# Altium project RBE3002.PrjPcb
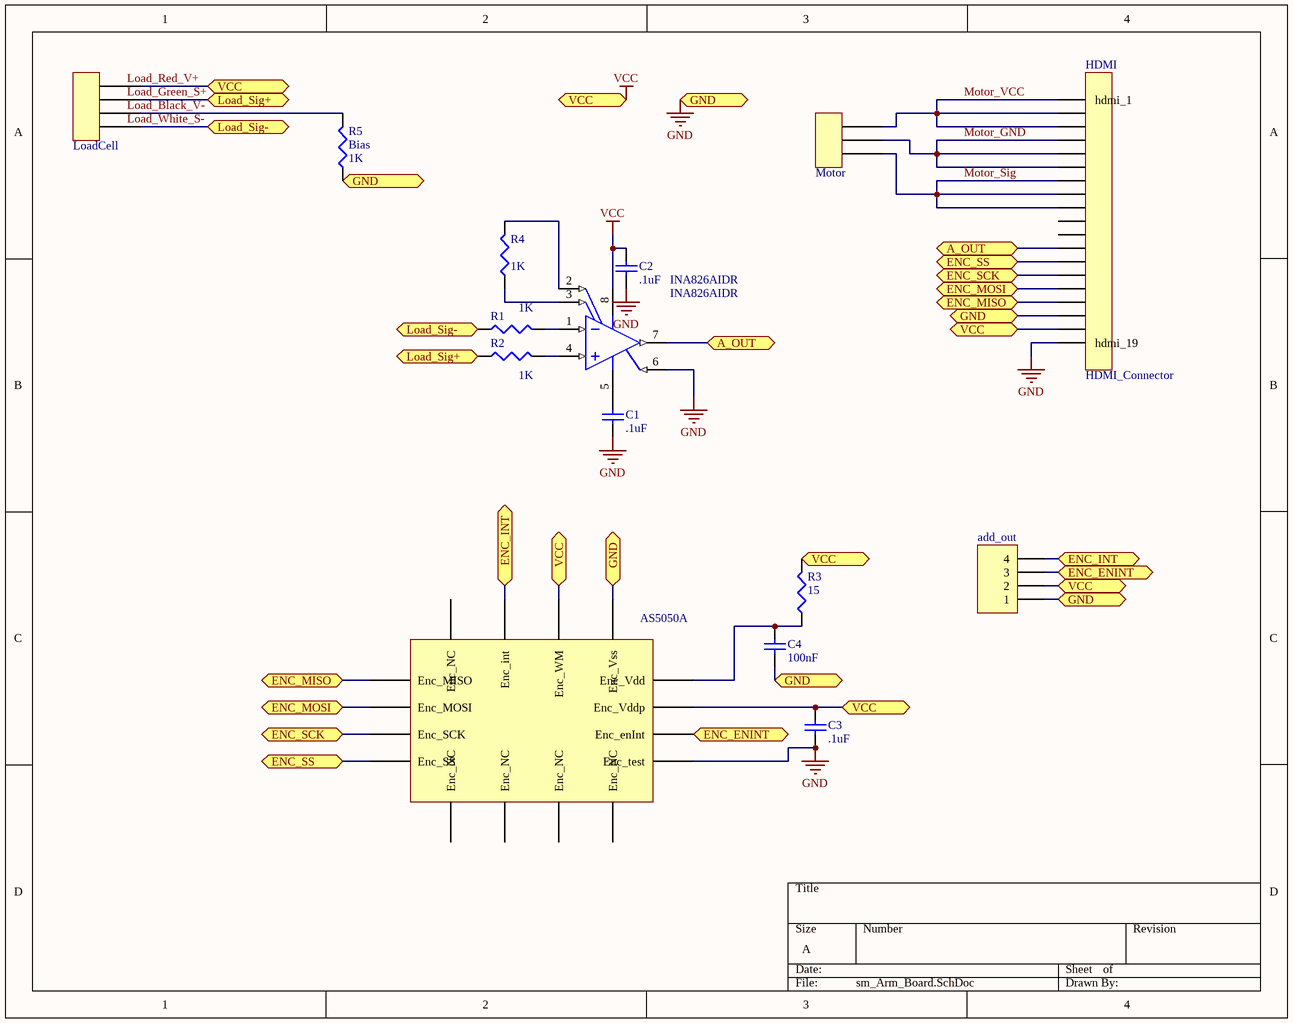
[diagram p0: sm_Arm_Board.SchDoc]
1 sheet, 15 parts. Net scope: flat (ports and power ports of the same name join across sheets).
Board file: sm_Arm_Board.PcbDoc

## Sheet sm_Arm_Board.SchDoc
size A

### Parts
3PinSM  Motor  [4PinSM]
4Pin_SM  LoadCell  [SOIC127P370X135-2N]
add_out  Header 4  [HDR1X4]  (value not drawn)
AS5050A  AS5050A  [AS5050A]  (value not drawn)
C1  value .1uF  [0402]  (hidden comment: Cap Semi)
C2  value .1uF  [0402]  (hidden comment: Cap Semi)
C3  value .1uF  [0402]  (hidden comment: Cap Semi)
C4  value 100nF  [0402]  (hidden comment: Cap Semi)
HDMI  HDMI_Connector  [685119136923]
INA826AIDR  INA826AIDR  [TI-D8_N]
R1  value 1K  [J1-0603]  (hidden comment: Res3)
R2  value 1K  [J1-0603]  (hidden comment: Res3)
R3  value 15  [J1-0603]  (hidden comment: Res3)
R4  value 1K  [J1-0603]  (hidden comment: Res3)
R5  Bias  value 1K  [J1-0603]

### Ports
A_OUT, ENC_ENINT, ENC_INT, ENC_MISO, ENC_MOSI, ENC_SCK, ENC_SS, GND, Load_Sig+, Load_Sig-, VCC

### Nets
GND: add_out.1 AS5050A.9(Enc_test) AS5050A.13(Enc_Vss) C1.1 C2.1 C3.1 C4.1 HDMI.hdmi_17 HDMI.hdmi_19 INA826AIDR.6(REF) R5.1 ; port GND
VCC: 4Pin_SM.4P4 add_out.2 AS5050A.11(Enc_Vddp) AS5050A.14(Enc_WM) C2.2 C3.2 HDMI.hdmi_18 INA826AIDR.8(VS+) R3.2 ; port VCC
Motor_GND: 3PinSM.3P2 HDMI.hdmi_4 HDMI.hdmi_5 HDMI.hdmi_6
Motor_Sig: 3PinSM.3P3 HDMI.hdmi_7 HDMI.hdmi_8 HDMI.hdmi_9
Motor_VCC: 3PinSM.3P1 HDMI.hdmi_1 HDMI.hdmi_2 HDMI.hdmi_3
Net4Pin_SM_4P1: 4Pin_SM.4P1 R1.1 ; port Load_Sig-
Net4Pin_SM_4P2: 4Pin_SM.4P2 R5.2
Net4Pin_SM_4P3: 4Pin_SM.4P3 R2.1 ; port Load_Sig+
Netadd_out_3: add_out.3 AS5050A.10(Enc_enInt) ; port ENC_ENINT
Netadd_out_4: add_out.4 AS5050A.15(Enc_int) ; port ENC_INT
NetAS5050A_1: AS5050A.1(Enc_MISO) HDMI.hdmi_16 ; port ENC_MISO
NetAS5050A_2: AS5050A.2(Enc_MOSI) HDMI.hdmi_15 ; port ENC_MOSI
NetAS5050A_3: AS5050A.3(Enc_SCK) HDMI.hdmi_14 ; port ENC_SCK
NetAS5050A_4: AS5050A.4(Enc_SS) HDMI.hdmi_13 ; port ENC_SS
NetAS5050A_12: AS5050A.12(Enc_Vdd) C4.2 R3.1
NetC1_2: C1.2 INA826AIDR.5(VS-)
NetHDMI_hdmi_12: HDMI.hdmi_12 INA826AIDR.7(VOUT) ; port A_OUT
NetINA826AIDR_1: INA826AIDR.1(IN-) R1.2
NetINA826AIDR_2: INA826AIDR.2(RG) R4.2
NetINA826AIDR_3: INA826AIDR.3(RG) R4.1
NetINA826AIDR_4: INA826AIDR.4(IN+) R2.2

Not connected (* = marked no-connect by the designer): AS5050A 5(Enc_NC) 6(Enc_NC) 7(Enc_NC) 8(Enc_NC) 16(Enc_NC); HDMI hdmi_10 hdmi_11

### Notes on the sheet
- Labels drawn without touching a wire or pin: Load_Black_V-, Load_Green_S+, Load_Red_V+, Load_White_S-

### Library data of the parts
3PinSM = 3PinSM: Digi-Key: 952-3196-6-ND
4Pin_SM = 4PinSM
add_out = Header 4: Header, 4-Pin; LatestRevisionDate: 17-Jul-2002; LatestRevisionNote: Re-released for DXP Platform.; Publisher: Altium Limited
C1-C4 = Cap Semi: Capacitor (Semiconductor SIM Model); Published: 8-Jun-2000; LatestRevisionDate: 29-May-2009; LatestRevisionNote: IPC-7351 Footprint Added.; PackageReference: C1206; Publisher: Altium Limited; PackageDescription: Chip Capacitor
INA826AIDR = INA826AIDR: Precision, 200-uA Supply Current, 36-V Supply Instrumentation Amplifier, -40 to 125 degC, 8-pin SOIC (D8), Green (RoHS & no Sb/Br); Manufacturer: Texas Instruments; CMRR(Min)(dB): 84; Gain(V/V): 1 to 1000; Input Bias Current (+/-)(Max)(nA): 65; Input Offset (+/-)(Max)(uV): 150; Input Offset Drift (+/-)(Max)(uV/Degrees Celsius): 2; Noise at 1kHz(Typ)(nV/rt(Hz)): 18; Non-Linearity (+/-)(Max)(%): 0.0005; Number of Channels: 1; Output Offset (+/-)(Max)(uV): 700; Output Offset Drift (+/-)(Max)(uV/Degrees Celsius): 10; Quiescent Current (+/-)(Typ)(mA): 0.2; SubFamily: Single Supply; Vs(Max)(V): 36; Vs(Min)(V): 2.7; DatasheetVersion: SBOS562E; PackageVersion: 4040047-3/M, 06/2011; PackageReference: D8; PackageDescription: 8-Pin Plastic Small Outline, Body 4.9 x 3.9 mm, Pitch 1.27 mm; Supplier 1: Digi-Key; Supplier Part Number 1: 296-30238-2-ND; Supplier 2: Digi-Key; Supplier Part Number 2: 296-30238-1-ND; Supplier 3: Digi-Key; Supplier Part Number 3: 296-30238-6-ND; Supplier 4: Newark; Supplier Part Number 4: 82T3832; Supplier 5: Mouser; Supplier Part Number 5: 595-INA826AIDR; Eco-Plan: Green (RoHS & no Sb/Br); Mounting Technology: Surface Mount; Code_JEDEC: MS-012; PartNumber: INA826AIDR; ComponentLink1Description: Manufacturer URL; ComponentLink1URL: http://www.ti.com/; ComponentLink2Description: Datasheet; ComponentLink2URL: http://www.ti.com/general/docs/lit/getliterature.tsp?genericPartNumber=INA826&fileType=pdf; ComponentLink3Description: Package Specification; ComponentLink3URL: http://www.ti.com/litv/pdf/msoi002j
R1-R5 = Res3: Resistor; Published: 8-Jun-2000; LatestRevisionDate: 29-May-2009; LatestRevisionNote: IPC-7351 Footprint Added.; PackageReference: J1-0603; Publisher: Altium Limited; PackageDescription: Chip Resistor